# EasyEDA Pro project ProProject_基于CW32单片机的旋转变压器软件解码_2024-01-23.epro

# Schematic 基于CW32单片机的旋转变压器软件解码
Create Date: 2024-01-16; Page Name: 基于CW32单片机的墙体探测仪; Project Name: 基于CW32单片机的旋转变压器软件解码; Schematic Name: 基于CW32单片机的旋转变压器软件解码; Update Date: 2024-01-21; Company: 嘉立创EDA; Page Size: A2; Version: V1.0
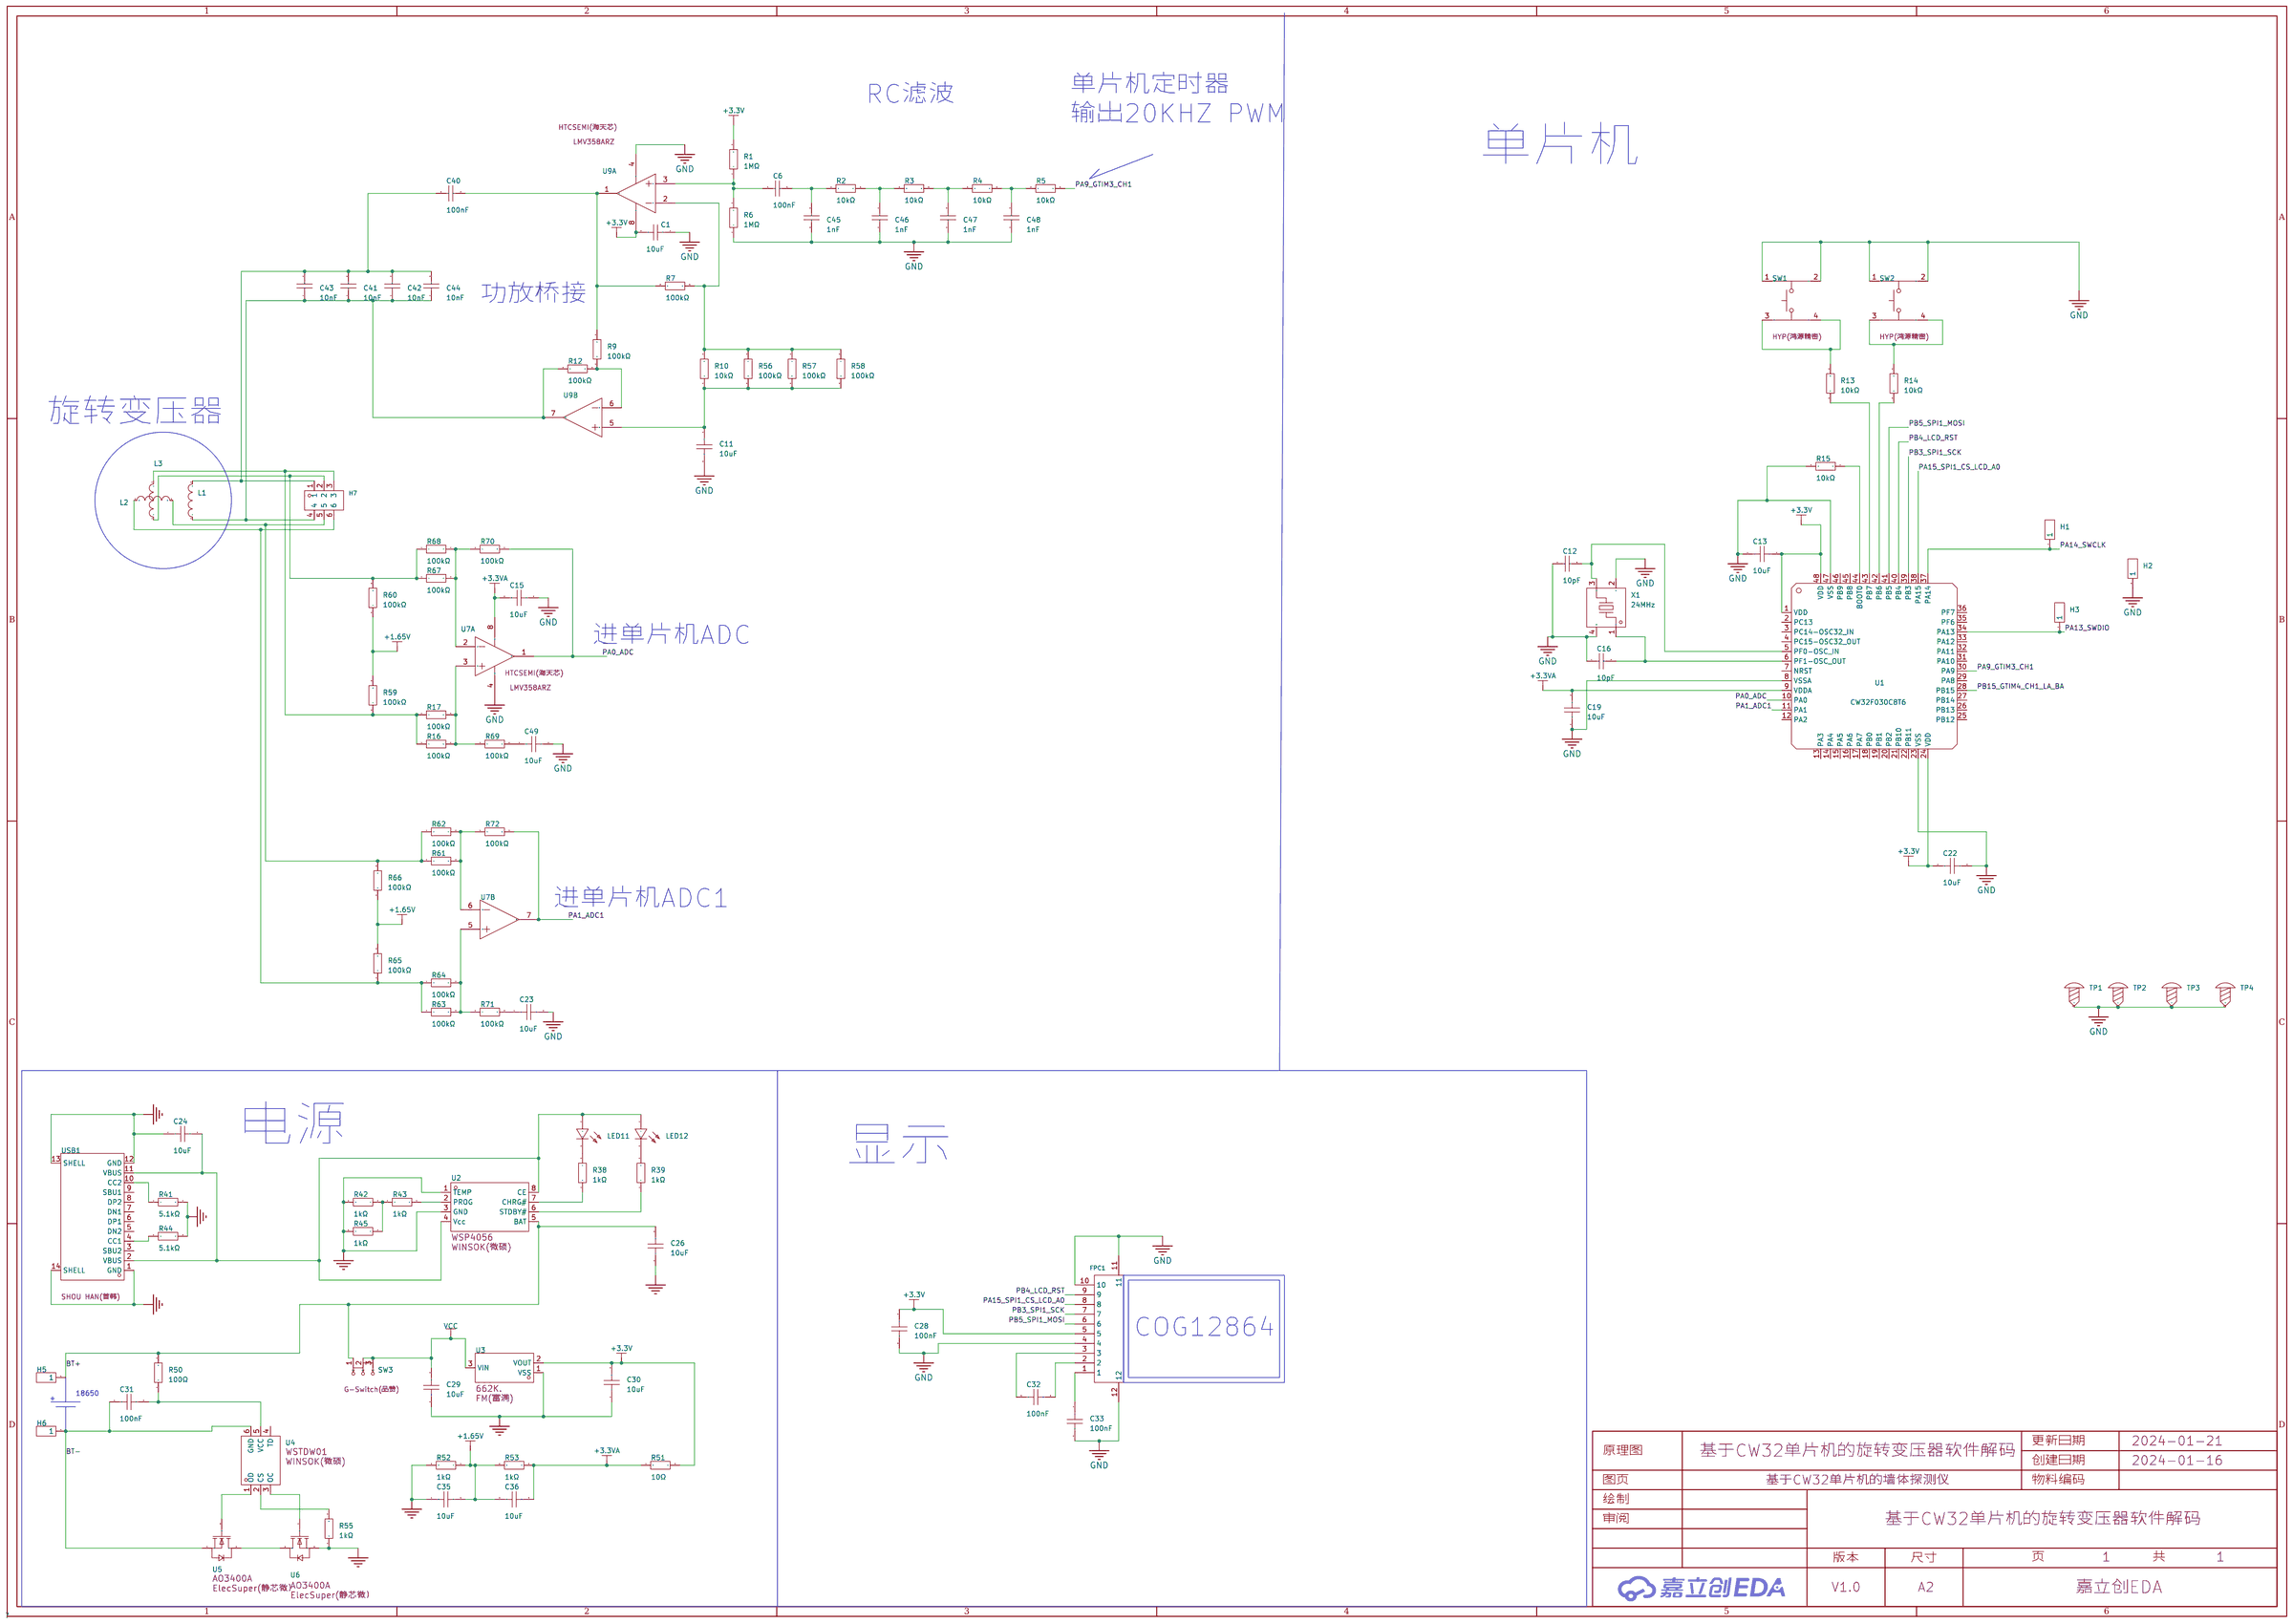
[diagram p0: schematic sheet]

## Parts
C1  10uF  [C0603]
C6  100nF  [C0603]
C11  10uF  [C0603]
C12  10pF  [C0603]
C13  10uF  [C0603]
C15  10uF  [C0603]
C16  10pF  [C0603]
C19  10uF  [C0603]
C22  10uF  [C0603]
C23  10uF  [C0603]
C24  10uF  [C0603]
C26  10uF  [C0603]
C28  100nF  [C0603]
C29  10uF  [C0603]
C30  10uF  [C0603]
C31  100nF  [C0603]
C32  100nF  [C0603]
C33  100nF  [C0603]
C35  10uF  [C0603]
C36  10uF  [C0603]
C40  100nF  [C0603]
C41  10nF  [C0603]
C42  10nF  [C0603]
C43  10nF  [C0603]
C44  10nF  [C0603]
C45  1nF  [C0603]
C46  1nF  [C0603]
C47  1nF  [C0603]
C48  1nF  [C0603]
C49  10uF  [C0603]
FPC1  -  [FPC-SMD_10P-P1.0_FGS-XJ-H2.0]
H1  -  [HDR-TH_1P-V-M_XKB_X4611WV-01I-C28D40]
H2  -  [HDR-TH_1P-V-M_XKB_X4611WV-01I-C28D40]
H3  -  [HDR-TH_1P-V-M_XKB_X4611WV-01I-C28D40]
H5  -  [HDR-TH_1P-V-M_XKB_X4611WV-01I-C28D40]
H6  -  [HDR-TH_1P-V-M_XKB_X4611WV-01I-C28D40]
H7  PZ254-2-03-Z-8.5  [HDR-TH_6P-P2.54-V-M-R2-C3-S2.54]
L1  6.3uH  [L1206]
L2  10uH  [L1206]
L3  10uH  [L1206]
LED11  204-10SURD/S530-A3-L  [LED-TH_BD3.0-P2.54-FD]
LED12  204-10SURD/S530-A3-L  [LED-TH_BD3.0-P2.54-FD]
R1  1MΩ  [R0603]
R2  10kΩ  [R0603]
R3  10kΩ  [R0603]
R4  10kΩ  [R0603]
R5  10kΩ  [R0603]
R6  1MΩ  [R0603]
R7  100kΩ  [R0603]
R9  100kΩ  [R0603]
R10  10kΩ  [R0603]
R12  100kΩ  [R0603]
R13  10kΩ  [R0603]
R14  10kΩ  [R0603]
R15  10kΩ  [R0603]
R16  100kΩ  [R0603]
R17  100kΩ  [R0603]
R38  1kΩ  [R0603]
R39  1kΩ  [R0603]
R41  5.1kΩ  [R0603]
R42  1kΩ  [R0603]
R43  1kΩ  [R0603]
R44  5.1kΩ  [R0603]
R45  1kΩ  [R0603]
R50  100Ω  [R0603]
R51  10Ω  [R0603]
R52  1kΩ  [R0603]
R53  1kΩ  [R0603]
R55  1kΩ  [R0603]
R56  100kΩ  [R0603]
R57  100kΩ  [R0603]
R58  100kΩ  [R0603]
R59  100kΩ  [R0603]
R60  100kΩ  [R0603]
R61  100kΩ  [R0603]
R62  100kΩ  [R0603]
R63  100kΩ  [R0603]
R64  100kΩ  [R0603]
R65  100kΩ  [R0603]
R66  100kΩ  [R0603]
R67  100kΩ  [R0603]
R68  100kΩ  [R0603]
R69  100kΩ  [R0603]
R70  100kΩ  [R0603]
R71  100kΩ  [R0603]
R72  100kΩ  [R0603]
SW1  -  [SW-TH_4P-L6.0-W6.0-P3.90-LS6.5]
SW2  -  [SW-TH_4P-L6.0-W6.0-P3.90-LS6.5]
SW3  SS-12F20-G070  [SW-TH_G-SWITCH_SS-12F20-G070]
TP1  -  [M3螺丝]
TP2  -  [M3螺丝]
TP3  -  [M3螺丝]
TP4  -  [M3螺丝]
U1  CW32F030C8T6  [LQFP-48_L7.0-W7.0-P0.50-LS9.0-TL]
U2  WSP4056  [SOP-8_L5.1-W3.9-P1.27-LS6.0-BL]
U3  662K.  [SOT-23-3_L2.9-W1.3-P1.90-LS2.4-BR]
U4  WSTDW01  [SOT-23-6_L2.9-W1.6-P0.95-LS2.8-BR]
U5  AO3400A  [SOT-23-3_L3.0-W1.6-P1.90-LS2.8-BR]
U6  AO3400A  [SOT-23-3_L3.0-W1.6-P1.90-LS2.8-BR]
U7  -  [SOP-8_L4.9-W3.9-P1.27-LS6.0-BL]  (sections 1,2)
U9  -  [SOP-8_L4.9-W3.9-P1.27-LS6.0-BL]  (sections 1,2)
USB1  TYPE-C16PIN2MD(073)  [USB-C-SMD_TYPE-C-6PIN-2MD-073]
X1  24MHz  [CRYSTAL-SMD_4P-L3.2-W2.5-BL]

## Library data of the parts
C1 C11 C13 C15 C19 C22-C24 C26 C29 C30 C35 C36 C49 = CL10A106KP8NNNC: 容值:10uF;精度:±10%;额定电压:10V;材质(温度系数):X5R;; LCSC Part Name: 10uF±10%10V; Supplier Part: C19702; Manufacturer: SAMSUNG(三星); Supplier Footprint: 0603; JLCPCB Part Class: BasicPart; Datasheet: https://atta.szlcsc.com/upload/public/pdf/source/20160103/1457707703378.pdf; Supplier: LCSC; Tolerance: ±10%; Voltage Rated: 10V; Temperature Coefficient: X5R
C6 C40 = 0603B104K500NT: 容值:100nF;精度:±10%;额定电压:50V;材质(温度系数):X7R;; LCSC Part Name: 100nF ±10% 50V; Supplier Part: C30926; Manufacturer: FH(风华); Supplier Footprint: 0603; JLCPCB Part Class: Extended Part; Datasheet: https://atta.szlcsc.com/upload/public/pdf/source/20200305/C486355_26A10D38EF8C2A5C37091D0039909270.pdf; Supplier: LCSC; Tolerance: ±10%; Voltage Rated: 50V; Temperature Coefficient: X7R
C12 C16 = CC0603JRNPO9BN100: 容值:10pF;精度:±5%;额定电压:50V;材质(温度系数):NP0;; LCSC Part Name: 10pF±5%50V; Supplier Part: C106245; Manufacturer: YAGEO(国巨); Supplier Footprint: 0603; JLCPCB Part Class: ExtendedPart; Datasheet: https://atta.szlcsc.com/upload/public/pdf/source/20170505/1493957837406.pdf; Supplier: LCSC; Tolerance: ±5%; Voltage Rated: 50V; Temperature Coefficient: NP0
C28 C31-C33 = CC0603KRX7R9BB104: 容值:100nF;精度:±10%;额定电压:50V;材质(温度系数):X7R;; LCSC Part Name: 100nF±10%50V; Supplier Part: C14663; Manufacturer: YAGEO(国巨); Supplier Footprint: 0603; JLCPCB Part Class: BasicPart; Datasheet: https://atta.szlcsc.com/upload/public/pdf/source/20180910/C282072_33301C7F631E79921B82A8DAC6BCC5B3.pdf; Supplier: LCSC; Tolerance: ±10%; Voltage Rated: 50V; Temperature Coefficient: X7R
C41-C44 = CC0603KRX7R9BB103: 容值:10nF;精度:±10%;额定电压:50V;材质(温度系数):X7R;; LCSC Part Name: 10nF ±10% 50V; Supplier Part: C100042; Manufacturer: YAGEO(国巨); Supplier Footprint: 0603; JLCPCB Part Class: 扩展库; Datasheet: https://atta.szlcsc.com/upload/public/pdf/source/20181008/C309510_22F155564471FAF6A489F7D68F34234E.pdf; Supplier: LCSC; Tolerance: ±10%; Voltage Rated: 50V; Temperature Coefficient: X7R
C45-C48 = CC0603JRNPO9BN102: 容值:1nF;精度:±5%;额定电压:50V;材质(温度系数):NP0;; LCSC Part Name: 1nF±5%50V; Supplier Part: C106246; Manufacturer: YAGEO(国巨); Supplier Footprint: 0603; JLCPCB Part Class: ExtendedPart; Datasheet: https://atta.szlcsc.com/upload/public/pdf/source/20170505/1493957838062.pdf; Supplier: LCSC; Tolerance: ±5%; Voltage Rated: 50V; Temperature Coefficient: NP0
FPC1 = AFA01-S10FCA-00: 间距:1mm;触点数量:10;锁定特性:翻盖式;安装类型:卧贴;触点类型:下接;; LCSC Part Name: FPC1.0MM10P翻盖式H2.0mm下接; Supplier Part: C262756; Manufacturer: JS(钜硕电子); Supplier Footprint: P=1mm; JLCPCB Part Class: ExtendedPart; Supplier: LCSC; Pitch: 1mm; Number of Contacts: 10; Locking Feature: 翻盖式; Mounting Type: 卧贴; Contact Type: 下接; Height Above Board: 2mm; FFC, FCB Thickness: 0.3mm~0.3mm
H1-H3 H5 H6 = HDR-M_2.54_1x1P: Supplier Part: C81276; Supplier Footprint: 插件; JLCPCB Part Class: ExtendedPart
H7 = PZ254-2-03-Z-8.5_C2894964: 排数:双排;总PIN位数:6;间距:2.54mm;插针结构:2x3P;行距:2.54mm;安装类型:直插;圆针/方针:方针;额定电流:3A;额定电压:-;配合针长度:6mm;塑高:2.5mm;端接针长度:3mm;触头材质:-;工作温度范围:-40℃~+105℃;颜色:黑色;; Supplier: LCSC; Supplier Part: C2894964; Manufacturer: HCTL(华灿天禄); JLCPCB Part Class: 扩展库; LCSC Part Name: 2.54mm 2x3P 直插 方针; Supplier Footprint: 直插,P=2.54mm; Number of Rows: 双排; Number of Pins: 6; Pitch: 2.54mm; Pin Structure: 2x3P; Row Spacing: 2.54mm; Mounting Type: 直插; Circluar Pins/Square Pins: 方针; Current Rating (Max): 3A; Length of Mating Pin: 6mm; Insulation Height: 2.5mm; Length of End Connection Pin: 3mm; Operating Temperature Range: -40℃~+105℃; Color: 黑色
L1-L3 = L_1206
LED11 LED12 = 204-10SURD/S530-A3-L: 发光颜色:红灯;二极管配置:-;主波长:624nm;色温:-;功率:60mW;安装方式:-;; LCSC Part Name: 红灯; Supplier Part: C99771; Manufacturer: EVERLIGHT(亿光); Supplier Footprint: 插件,D=3mm; JLCPCB Part Class: ExtendedPart; Datasheet: https://atta.szlcsc.com/upload/public/pdf/source/20170504/1493866972127.pdf; Supplier: LCSC; Emitted Color: 红灯; Lens Color: 雾状红; Dominant Wavelength: 624nm; Peak Wavelength: 632nm; Forward Current: 20mA; Power Dissipation: 60mW; Viewing Angle: 40°; Operating Temperature: -40℃~+85℃; Lamp Holder Type: 3mm圆形灯头
R1 R6 = 0603WAF1004T5E: 电阻类型:厚膜电阻;阻值:1MΩ;精度:±1%;功率:100mW;; LCSC Part Name: 1MΩ±1%100mW; Supplier Part: C22935; Manufacturer: UNI-ROYAL(厚声); Supplier Footprint: 0603; JLCPCB Part Class: BasicPart; Datasheet: https://atta.szlcsc.com/upload/public/pdf/source/20200306/C422600_1E6D84923E4A46A82E41ADD87F860B5C.pdf; Supplier: LCSC; Type: 厚膜电阻; Tolerance: ±1%; Power(Watts): 100mW; Temperature Coefficient: ±100ppm/℃; Overload Voltage (Max): 75V; Operating Temperature Range: -55℃~+155℃
R2-R5 R10 R13-R15 R41 R44 = RC0603FR-0710KL: 电阻类型:厚膜电阻;阻值:10kΩ;精度:±1%;功率:100mW;; LCSC Part Name: 10kΩ±1%100mW; Supplier Part: C98220; Manufacturer: YAGEO(国巨); Supplier Footprint: 0603; JLCPCB Part Class: ExtendedPart; Datasheet: https://atta.szlcsc.com/upload/public/pdf/source/20170522/1495423494387.pdf; Supplier: LCSC; Type: 厚膜电阻; Tolerance: ±1%; Power(Watts): 100mW; Temperature Coefficient: ±100ppm/℃; Overload Voltage (Max): 75V; Operating Temperature Range: -55℃~+155℃
R7 R9 R12 R16 R17 R56-R72 = RC0603FR-07100KL: 电阻类型:厚膜电阻;阻值:100kΩ;精度:±1%;功率:100mW;; LCSC Part Name: 100kΩ±1%100mW; Supplier Part: C14675; Manufacturer: YAGEO(国巨); Supplier Footprint: 0603; JLCPCB Part Class: ExtendedPart; Datasheet: https://atta.szlcsc.com/upload/public/pdf/source/20140324/1457707028752.pdf; Supplier: LCSC; Type: 厚膜电阻; Tolerance: ±1%; Power(Watts): 100mW; Temperature Coefficient: ±100ppm/℃; Overload Voltage (Max): 75V; Operating Temperature Range: -55℃~+155℃
R38 R39 R42 R43 R45 R52 R53 R55 = RC0603FR-071KL: 电阻类型:厚膜电阻;阻值:1kΩ;精度:±1%;功率:100mW;; LCSC Part Name: 1kΩ±1%100mW; Supplier Part: C22548; Manufacturer: YAGEO(国巨); Supplier Footprint: 0603; JLCPCB Part Class: ExtendedPart; Datasheet: https://atta.szlcsc.com/upload/public/pdf/source/20180312/7BD3618A8B6324EA6280B0497A051AB7.pdf; Supplier: LCSC; Type: 厚膜电阻; Tolerance: ±1%; Power(Watts): 100mW; Temperature Coefficient: ±100ppm/℃; Overload Voltage (Max): 75V; Operating Temperature Range: -55℃~+155℃
R50 = RC0603FR-07100RL: 电阻类型:厚膜电阻;阻值:100Ω;精度:±1%;功率:100mW;; LCSC Part Name: 100Ω±1%100mW; Supplier Part: C105588; Manufacturer: YAGEO(国巨); Supplier Footprint: 0603; JLCPCB Part Class: ExtendedPart; Datasheet: https://atta.szlcsc.com/upload/public/pdf/source/20170428/1493376742308.pdf; Supplier: LCSC; Type: 厚膜电阻; Tolerance: ±1%; Power(Watts): 100mW; Temperature Coefficient: ±100ppm/℃; Overload Voltage (Max): 75V; Operating Temperature Range: -55℃~+155℃
R51 = 0603WAF100JT5E: 电阻类型:厚膜电阻;阻值:10Ω;精度:±1%;功率:100mW;; LCSC Part Name: 10Ω±1%100mW; Supplier Part: C22859; Manufacturer: UNI-ROYAL(厚声); Supplier Footprint: 0603; JLCPCB Part Class: BasicPart; Datasheet: https://atta.szlcsc.com/upload/public/pdf/source/20200306/C422600_1E6D84923E4A46A82E41ADD87F860B5C.pdf; Supplier: LCSC; Type: 厚膜电阻; Tolerance: ±1%; Power(Watts): 100mW; Temperature Coefficient: ±400ppm/℃; Overload Voltage (Max): 75V; Operating Temperature Range: -55℃~+155℃
SW1 SW2 = 1TS005A-2500-5001: 触点电流:50mA;额定电压(DC):12V;额定功率:0.6W;绝缘电阻:100MΩ;电路结构:单刀单掷;安装方式:直插;带灯:无;作用力:250gf@±50gf;机械寿命:7万次;带支架:否;; LCSC Part Name: 6*6*5mm直插轻触开关; Supplier Part: C255811; Manufacturer: HYP(鸿源精密); Supplier Footprint: 插件,6x6mm; JLCPCB Part Class: ExtendedPart; Datasheet: https://atta.szlcsc.com/upload/public/pdf/source/20180720/C255811_DA12C4E3C20854D48E888AEA64926F5F.pdf; Supplier: LCSC; Contact Current: 50mA; Voltage Rating (DC): 12V; Power Rating: 0.6W; Insulation Resistance: 100MΩ; Circuit: 单刀单掷; Mounting Style: 直插; Actuator Style: 圆形按钮; Actuator/Cap Color: 黑色; With Lamp: 无; Operating Force: 250gf@±50gf; Mechanical Life: 7万次; Operating Temperature: -40℃~+90℃; Pin Style: PC引脚; Switch Length: 6mm; Switch Width: 6mm; Switch Height: 5mm; Strike Gundam: 否
SW3 = SS-12F20-G070: 额定电流(DC):500mA;额定电压(DC):250V;电路结构:单刀双掷;安装方式:直插;机械寿命:-;开关颜色:黑色;; LCSC Part Name: 柄长7mm直插两档滑动开关; Supplier Part: C2848914; Manufacturer: G-Switch(品赞); Supplier Footprint: 插件; JLCPCB Part Class: ExtendedPart; Datasheet: https://atta.szlcsc.com/upload/public/pdf/source/20210825/E0137178672C137814869A76188F885C.pdf; Supplier: LCSC; Current Rating (DC): 500mA; Voltage Rating (DC): 250V; Circuit: 单刀双掷; Mounting Style: 直插; Actuator Color: 黑色; Actuator Style: 矩形柱状; Pin Style: PC引脚; Switch Length: 11.5mm; Switch Width: 5.8mm; Switch Height: 12mm
TP1-TP4 = M3螺丝: Supplier Footprint: 插件
U1 = CW32F030C8T6_C3019113: CPU内核:ARMCortex-M0+;CPU最大主频:64MHz;工作电压范围:1.65V~5.5V;内部振荡器:有;外部时钟频率范围:4MHz~32MHz;程序FLASH容量:-;RAM总容量:8KB;EEPROM/数据FLASH容量:-;GPIO端口数量:39;ADC(单元数/通道数/位数):1@x16ch/12bit;DAC(单元数/通道数/位数):-;(E)PWM(单元数/通道数/位数):-;8位Timer数量:-;16位Timer数量:8;32位Timer数量:-;内部比较器数量:2;U; LCSC Part Name: ARMCortex-M0+64MHzRAM：8KB; Supplier Part: C3019113; Manufacturer: CW(芯源); Supplier Footprint: LQFP-48; JLCPCB Part Class: ExtendedPart; Datasheet: https://atta.szlcsc.com/upload/public/pdf/source/20220516/D60F5E1023A73FFF550D4A77416DDFBC.pdf; Supplier: LCSC; CPU Core: ARMCortex-M0+; Maximum Frequency: 64MHz; Supply Voltage Range: 1.65V~5.5V; Internal Oscillator: 有; External Clock Frequency Rang: 4MHz~32MHz; RAM Size: 8KB; GPIO Ports Number: 39; ADC (Units/Channels/bits): 1@x16ch/12bit; 16Bit Timer Number: 8; CMP Number: 2; U(S)ART Number: 3; I2C Number: 2; (Q)SPI Number: 2; Peripherals / Functions / Protocol Stacks: 片载温度传感器；DMA；看门狗；低电压检测；CRC校验; Operating Temperature Range: -40℃~105℃
U2 = WSP4056: Supplier Part: C2985892; Manufacturer: WINSOK(微硕); Supplier Footprint: SOP-8; JLCPCB Part Class: ExtendedPart; Supplier: LCSC
U3 = 662K.: 输出类型:-;; LCSC Part Name: 662K; Supplier Part: C841298; Manufacturer: FM(富满); Supplier Footprint: SOT23-3; JLCPCB Part Class: ExtendedPart; Datasheet: https://atta.szlcsc.com/upload/public/pdf/watermark/20200922/C841298_3E220732626B158CD6AC195AF78C7FB8.pdf; Supplier: LCSC
U4 = WSTDW01: 充电电池的类型:-;电池单元组数:-;最大充电电流:-;充满的电池组电压:-;最大供应电压:-;; Supplier Part: C86873; Manufacturer: WINSOK(微硕); Supplier Footprint: SOT-23-6; JLCPCB Part Class: ExtendedPart; Datasheet: https://atta.szlcsc.com/upload/public/pdf/source/20161110/1478743415995.pdf; Supplier: LCSC
U5 U6 = AO3400A_C5224194: 类型:N沟道;漏源电压(Vdss):30V;连续漏极电流(Id):6A;功率(Pd):1.4W;导通电阻(RDS(on)@Vgs,Id):19mΩ@10V,6.0A;; LCSC Part Name: N沟道30V6A; Supplier Part: C5224194; Manufacturer: ElecSuper(静芯微）; Supplier Footprint: SOT-23-3L; JLCPCB Part Class: ExtendedPart; Datasheet: https://atta.szlcsc.com/upload/public/pdf/source/20221027/D95D9171DDBB7BB324532F3AF1EADB7E.pdf; Supplier: LCSC; Type: N沟道; Drain Source Voltage (Vdss): 30V; Continuous Drain Current (Id): 6A; Power Dissipation (Pd): 1.4W; Drain Source On Resistance (RDS(on)@Vgs,Id): 19mΩ@10V,6.0A; Gate Threshold Voltage (Vgs(th)@Id): 1V@250uA
U7 U9 = LMV358ARZ: CMOS低功耗双路运算放大器; Supplier Part: C2928823; Manufacturer: HTCSEMI(海天芯); Supplier Footprint: SOP-8; JLCPCB Part Class: ExtendedPart; Datasheet: https://atta.szlcsc.com/upload/public/pdf/source/20220114/2D4B849A76DE33264688A93B3A90A0F8.pdf; Supplier: LCSC
USB1 = TYPE-C 16PIN 2MD(073): 连接器类型:Type-C;标准:-;公母:母座;触点数量:16;端口数量:1;安装方式:卧贴;额定电流-电源:5A;工作温度范围:-25℃~+85℃;; LCSC Part Name: TYPE-C母座16P4脚插件带定位柱不锈钢外壳2次模顶; Supplier Part: C2765186; Manufacturer: SHOU HAN(首韩); Supplier Footprint: SMD; JLCPCB Part Class: ExtendedPart; Datasheet: https://atta.szlcsc.com/upload/public/pdf/source/20211123/39B17C16241EAC15C5E277BDA434118E.pdf; Supplier: LCSC; Connector Type: Type-C; Gender: 母座; Number of Contacts: 16; Number of Ports: 1; Mounting Style: 卧贴; Current Rating - Power (Max): 5A; Operating Temperature Range: -25℃~+85℃
X1 = 3TJ424000HYFBC: 频率:24MHz;频率公差:±10ppm;负载电容:9pF;; LCSC Part Name: 24MHz ±10ppm 9pF; Supplier Part: C2149055; Manufacturer: JYJE(晶友嘉); Supplier Footprint: SMD3225-4P; JLCPCB Part Class: Extended Part; Datasheet: https://atta.szlcsc.com/upload/public/pdf/source/20210114/C2149013_C841380407E0329693B4ECED06382C6A.pdf; Supplier: LCSC; Crystal Type: 贴片无源晶振; Frequency Tolerance: ±10ppm; Frequency Stability: ±30ppm; Load Capacitance: 9pF; Equivalent Series Resistance (ESR): 60Ω; Operating Temperature: -40℃~+85℃

## Nets
+1.65V: C35.2 C36.1 R52.1 R53.2 R59.2 R60.1 R65.2 R66.1
+3.3V: C1.2 C13.2 C22.1 C28.1 C30.2 FPC1.5 R1.2 R51.2 U1.1(VDD) U1.24(VDD) U1.48(VDD) U3.2(VOUT) U9.8(VCC)
+3.3VA: C15.2 C19.2 C36.2 R51.1 R53.1 U1.9(VDDA) U7.8(VCC)
GND: C1.1 C11.2 C12.1 C13.1 C15.1 C16.1 C19.1 C22.2 C23.2 C24.1 C26.1 C28.2 C29.1 C30.1 C33.2 C35.1 C45.1 C46.1 C47.1 C48.1 C49.2 FPC1.4 FPC1.10 FPC1.11 FPC1.12 H2.1 R6.1 R15.2 R41.2 R42.2 R44.2 R45.2 R52.2 R55.1 SW1.1 SW1.2 SW2.1 SW2.2 TP1.1 TP2.1 TP3.1 TP4.1 U1.8(VSSA) U1.23(VSS) U1.47(VSS) U2.1(TEMP) U2.3(GND) U3.1(VSS) U6.2(S) U7.4(GND) U9.4(GND) USB1.1(GND) USB1.12(GND) USB1.13(SHELL) USB1.14(SHELL) X1.2(GND) X1.4(GND)
VCC: C29.2 SW3.2 SW3.3 U3.3(VIN)
BT+: C26.2 H5.1 R50.2 SW3.1 U2.5(BAT)
BT-: C31.1 H6.1 U4.6(GND) U5.2(S)
PA0_ADC: R70.2 U1.10(PA0) U7.1(OUT)
PA1_ADC1: R72.2 U1.11(PA1) U7.7(OUT2)
PA9_GTIM3_CH1: R5.2 U1.30(PA9)
PA13_SWDIO: H3.1 U1.34(PA13)
PA14_SWCLK: H1.1 U1.37(PA14)
PA15_SPI1_CS_LCD_A0: FPC1.8 U1.38(PA15)
PB3_SPI1_SCK: FPC1.7 U1.39(PB3)
PB4_LCD_RST: FPC1.9 U1.40(PB4)
PB5_SPI1_MOSI: FPC1.6 U1.41(PB5)
PB15_GTIM4_CH1_LA_BA: U1.28(PB15)
$1N13991: U5.3(D) U6.3(D)
$1N14154: U4.1(OD) U5.1(G)
$1N14198: U4.3(OC) U6.1(G)
$1N14351: R55.2 U4.2(CS)
$1N15015: R43.1 U2.2(PROG)
$1N15845: R38.1 U2.7(CHRG#)
$1N15894: R39.1 U2.6(STDBY#)
$1N16826: R44.1 USB1.4(CC1)
$1N16875: R41.1 USB1.10(CC2)
$1N19532: C31.2 R50.1 U4.5(VCC)
$1N165486: R42.1 R43.2 R45.1
$1N167672: C24.2 LED11.1(A) LED12.1(A) U2.4(Vcc) U2.8(CE) USB1.2(VBUS) USB1.11(VBUS)
$1N179497: LED11.2(K) R38.2
$1N179538: LED12.2(K) R39.2
$1N206778: R15.1 U1.44(BOOT0)
$1N234129: R13.1 SW1.3 SW1.4
$1N234138: R14.1 SW2.3 SW2.4
$1N234147: R13.2 U1.43(PB7)
$1N234151: R14.2 U1.42(PB6)
$1N252869: C33.1 FPC1.1
$1N252872: C32.2 FPC1.2
$1N252875: C32.1 FPC1.3
$1N256375: C46.2 R2.2 R3.1
$1N256389: C47.2 R3.2 R4.1
$1N256398: C48.2 R4.2 R5.1
$1N256743: C6.2 C45.2 R2.1
$1N263980: C6.1 R1.1 R6.2 U9.3(IN1+)
$1N274948: C16.2 U1.6(PF1-OSC_OUT) X1.1
$1N275074: C12.2 U1.5(PF0-OSC_IN) X1.3
$1N291348: R9.2 R12.1 U9.6(IN2-)
$1N303075: C40.2 R7.1 R9.1 U9.1(OUT)
$1N308887: R7.2 R10.2 R56.1 R57.1 R58.1 U9.2(IN1-)
$1N309457: C11.1 R10.1 R56.2 R57.2 R58.2 U9.5(IN2+)
Net-(C23-1): C23.1 R71.2
Net-(C40-1): C40.1 C41.2 C42.2 C43.2 C44.2 H7.1 L1.2
Net-(C41-1): C41.1 C42.1 C43.1 C44.1 H7.4 L1.1 R12.2 U9.7(OUT2)
Net-(C49-1): C49.1 R69.2
Net-(H7-2): H7.2 L3.1 R60.2 R67.1 R68.1
Net-(H7-3): H7.3 L3.2 R16.1 R17.1 R59.1
Net-(H7-5): H7.5 L2.2 R61.1 R62.1 R66.2
Net-(H7-6): H7.6 L2.1 R63.1 R64.1 R65.1
Net-(R16-2): R16.2 R17.2 R69.1 U7.3(IN1+)
Net-(R61-2): R61.2 R62.2 R72.1 U7.6(IN2-)
Net-(R63-2): R63.2 R64.2 R71.1 U7.5(IN2+)
Net-(R67-2): R67.2 R68.2 R70.1 U7.2(IN1-)

Not connected (* = marked no-connect by the designer): U1 2(PC13) 3(PC14-OSC32_IN) 4(PC15-OSC32_OUT) 7(NRST) 12(PA2) 13(PA3) 14(PA4) 15(PA5) 16(PA6) 17(PA7) 18(PB0) 19(PB1) 20(PB2) 21(PB10) 22(PB11) 25(PB12) 26(PB13) 27(PB14) 29(PA8) 31(PA10) 32(PA11) 33(PA12) 35(PF6) 36(PF7) 45(PB8) 46(PB9); U4 4(TD); USB1 3(SBU2) 5(DN2) 6(DP1) 7(DN1) 8(DP2) 9(SBU1)

## Notes on the sheet
- RC滤波
- 单片机定时器
  输出20KHZ PWM
- 单片机
- 功放桥接
- 旋转变压器
- 进单片机ADC
- 进单片机ADC1
- 电源
- 显示
- COG12864
- +
- 18650

# Board PCB3
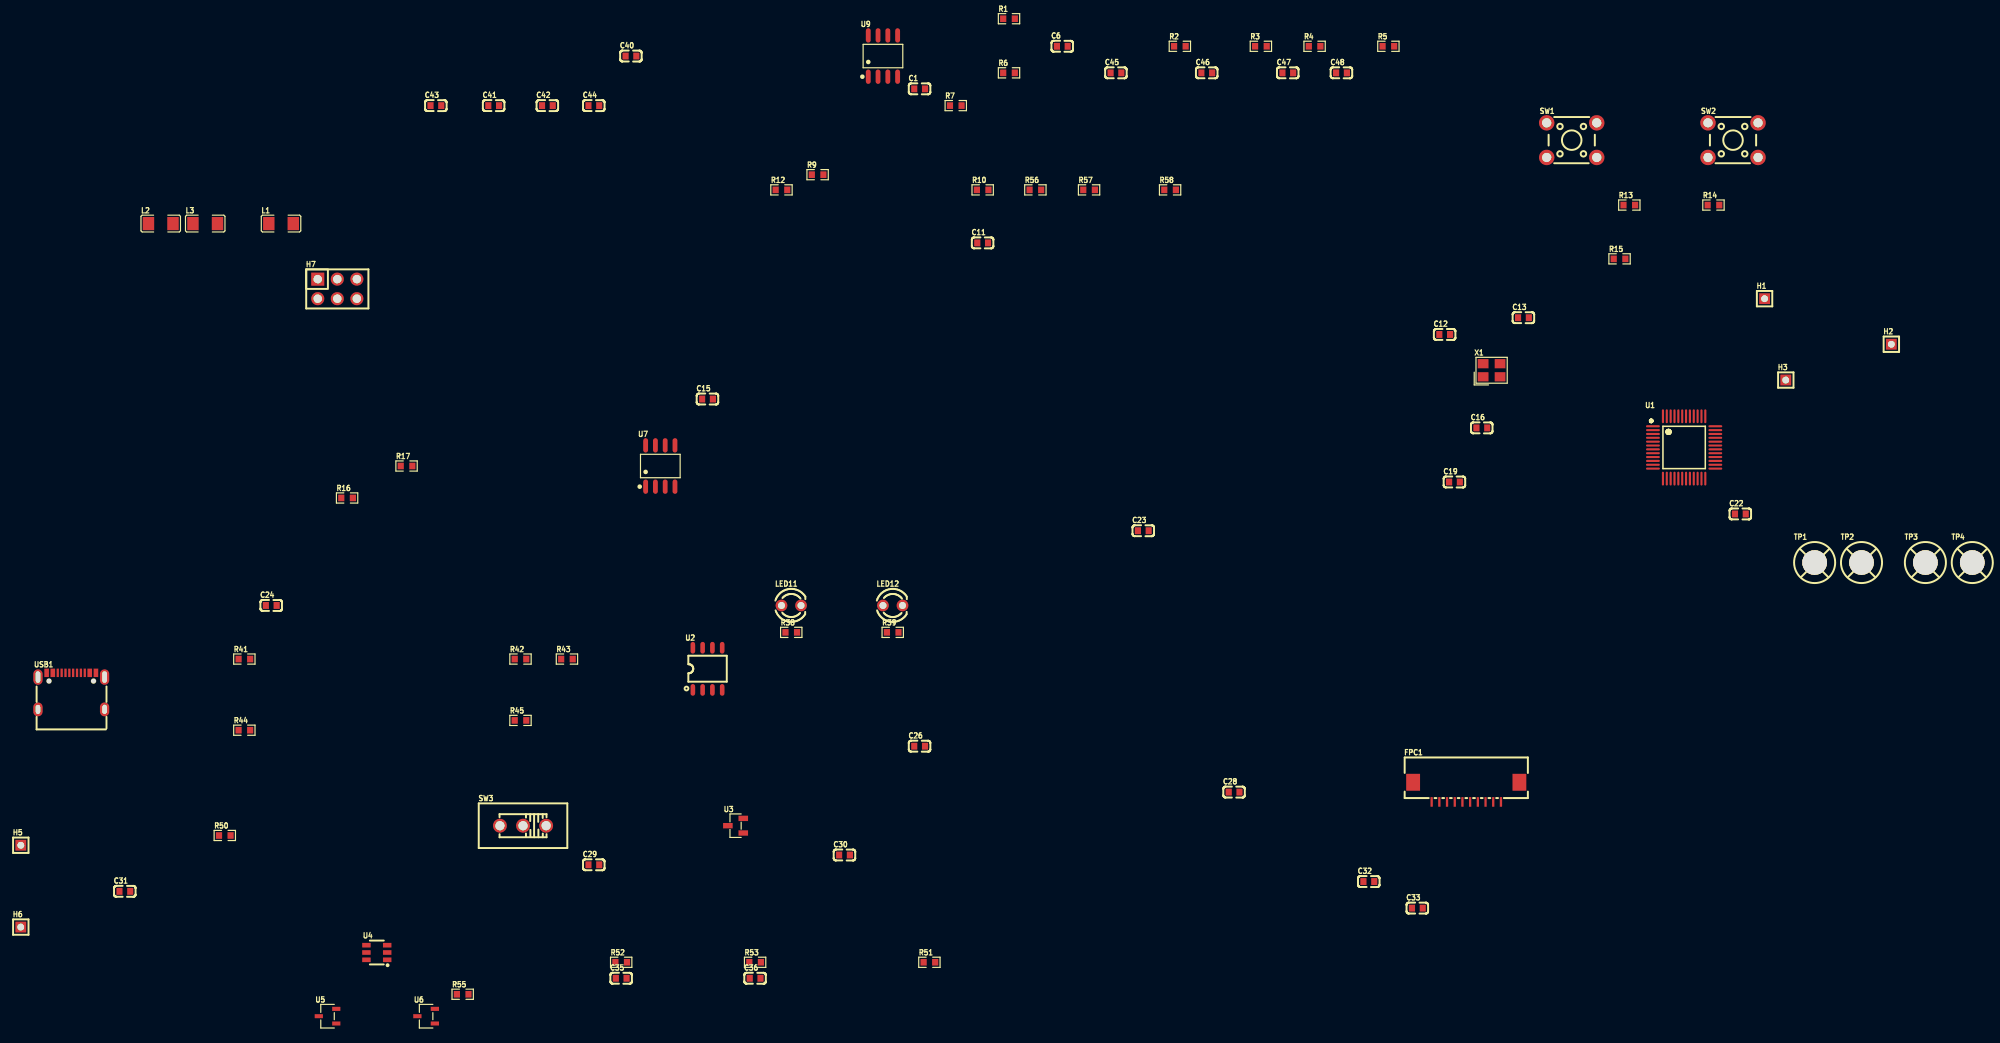
[diagram p1: board, top side]
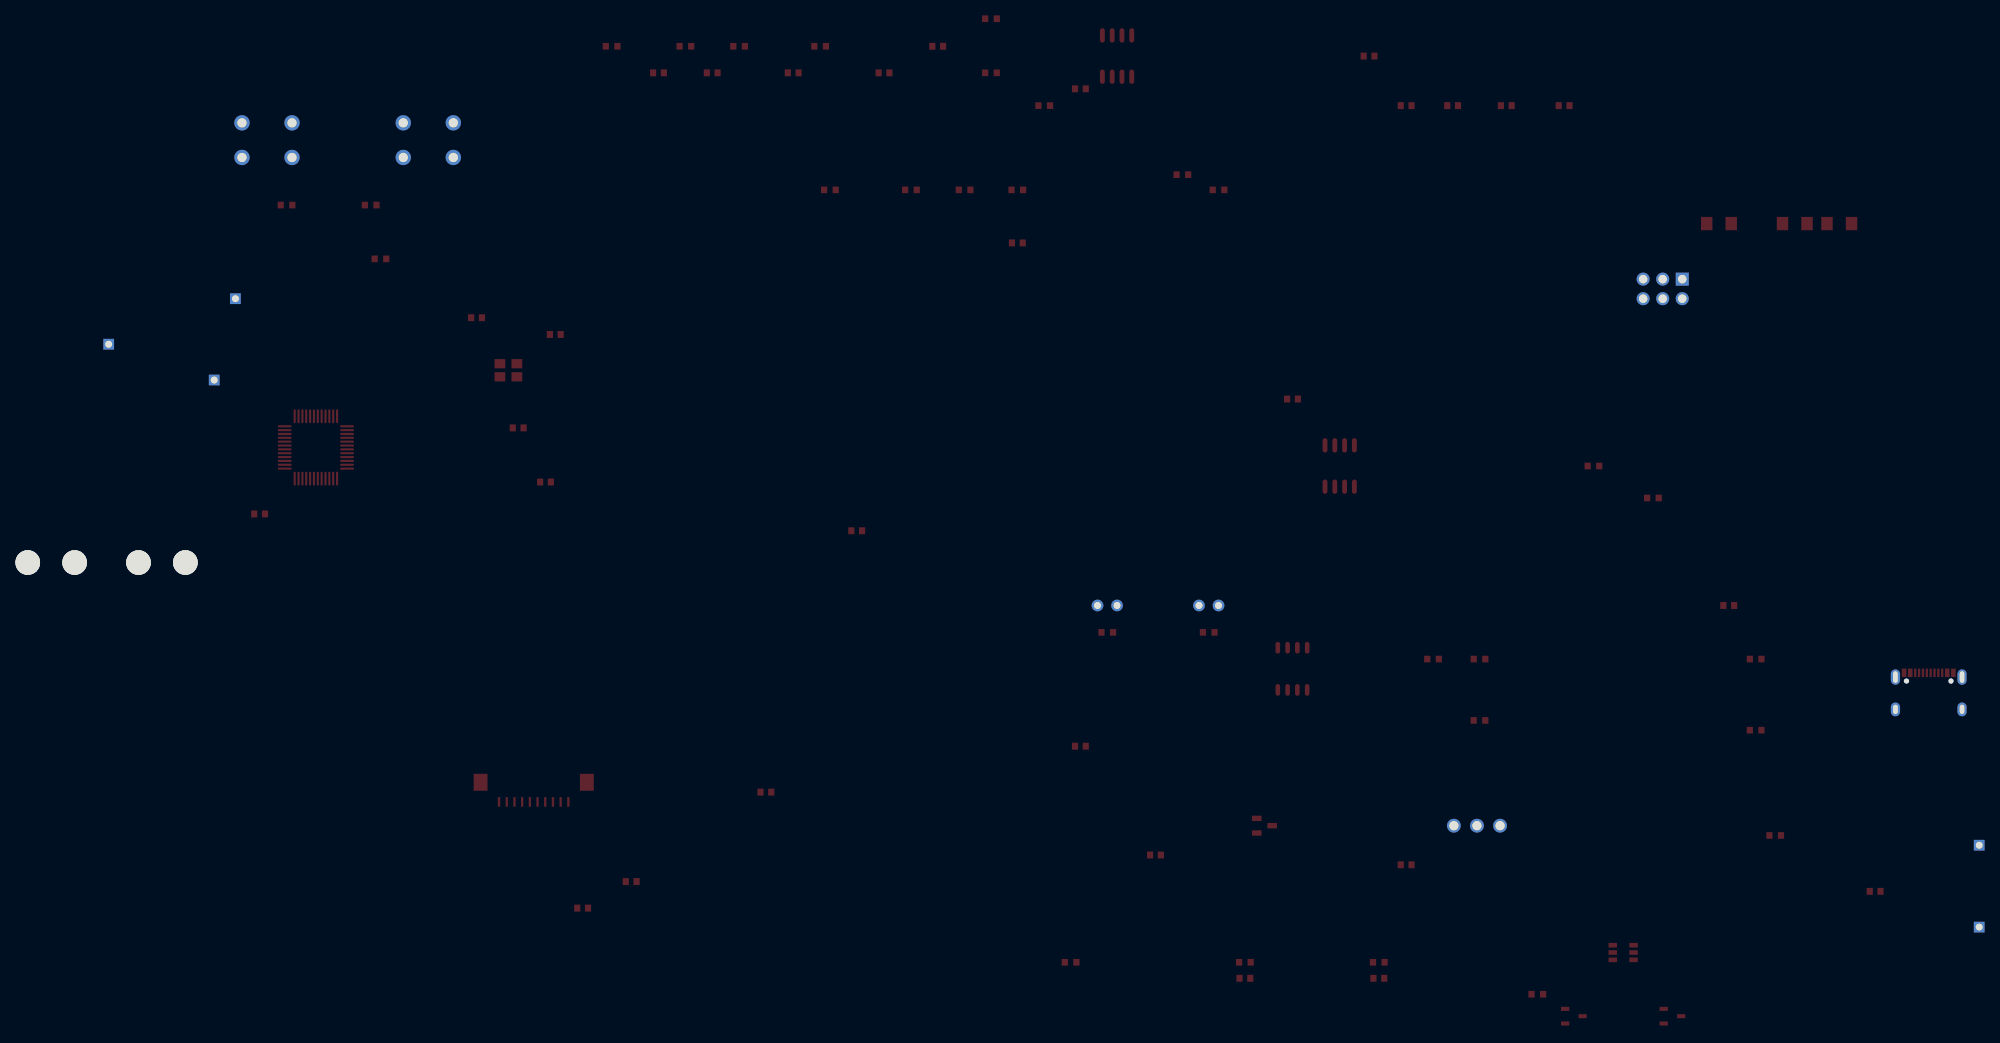
[diagram p2: board, bottom side, seen from below]

Outline 6.47 x 0.69 mm; copper layers: Top Layer, Bottom Layer. Coordinates in mm from the lower left corner of the outline.
Stack: Top Layer 0.035mm / Dielectric1 1.51mm FR4 er 4.5 / Bottom Layer 0.035mm

## Design rules (mm)
template: JLCPCB Capability(Two Layers Board)
spacing copperThickness1oz (default): track to track 0.102, other pairs 0.152 to 0.3
spacing copperThickness2oz: track to track 0.203, other pairs 0.152 to 0.3
track width copperThickness1oz (default): min 0.127, default 0.254, max 2.54
track width copperThickness2oz: min 0.203, default 0.254, max 2.54
differential pair differentialPair (default): width min 0.127, default 0.254, max 2.54; gap min 0.152, default 0.152
via viaSize (default): diameter min 0.5, default 0.61, max 10; hole min 0.3, default 0.305, max 6.3

## Placement (name value [footprint] x y rotation side)
C1  10uF  [C0603]  113.4 77.29 0 top
C6  100nF  [C0603]  131.93 82.82 0 top
C11  10uF  [C0603]  121.59 57.28 0 top
C12  10pF  [C0603]  181.59 45.38 0 top
C13  10uF  [C0603]  191.82 47.56 0 top
C15  10uF  [C0603]  85.86 36.99 0 top
C16  10pF  [C0603]  186.41 33.24 0 top
C19  10uF  [C0603]  182.86 26.21 0 top
C22  10uF  [C0603]  219.98 22.06 0 top
C23  10uF  [C0603]  142.45 19.88 0 top
C24  10uF  [C0603]  29.21 10.17 0 top
C26  10uF  [C0603]  113.4 -8.12 0 top
C28  100nF  [C0603]  154.24 -14.08 0 top
C29  10uF  [C0603]  71.1 -23.52 0 top
C30  10uF  [C0603]  103.65 -22.25 0 top
C31  100nF  [C0603]  10.2 -26.97 0 top
C32  100nF  [C0603]  171.74 -25.7 0 top
C33  100nF  [C0603]  178.04 -29.15 0 top
C35  10uF  [C0603]  74.65 -38.27 0 top
C36  10uF  [C0603]  92.04 -38.27 0 top
C40  100nF  [C0603]  75.92 81.55 0 top
C41  10nF  [C0603]  58.09 75.11 0 top
C42  10nF  [C0603]  65.07 75.11 0 top
C43  10nF  [C0603]  50.59 75.11 0 top
C44  10nF  [C0603]  71.1 75.11 0 top
C45  1nF  [C0603]  138.9 79.37 0 top
C46  1nF  [C0603]  150.69 79.37 0 top
C47  1nF  [C0603]  161.21 79.37 0 top
C48  1nF  [C0603]  168.19 79.37 0 top
FPC1  -  [FPC-SMD_10P-P1.0_FGS-XJ-H2.0]  184.39 -14.08 0 top
H1  -  [HDR-TH_1P-V-M_XKB_X4611WV-01I-C28D40]  223.13 50.03 0 top
H2  -  [HDR-TH_1P-V-M_XKB_X4611WV-01I-C28D40]  239.59 44.11 0 top
H3  -  [HDR-TH_1P-V-M_XKB_X4611WV-01I-C28D40]  225.88 39.46 0 top
H5  -  [HDR-TH_1P-V-M_XKB_X4611WV-01I-C28D40]  -3.32 -20.98 0 top
H6  -  [HDR-TH_1P-V-M_XKB_X4611WV-01I-C28D40]  -3.32 -31.62 0 top
H7  PZ254-2-03-Z-8.5  [HDR-TH_6P-P2.54-V-M-R2-C3-S2.54]  37.78 51.3 0 top
L1  6.3uH  [L1206]  30.48 59.79 0 top
L2  10uH  [L1206]  14.85 59.79 0 top
L3  10uH  [L1206]  20.63 59.79 0 top
LED11  204-10SURD/S530-A3-L  [LED-TH_BD3.0-P2.54-FD]  96.73 10.17 0 top
LED12  204-10SURD/S530-A3-L  [LED-TH_BD3.0-P2.54-FD]  109.91 10.17 0 top
R1  1MΩ  [R0603]  125.01 86.4 0 top
R2  10kΩ  [R0603]  147.2 82.82 0 top
R3  10kΩ  [R0603]  157.72 82.82 0 top
R4  10kΩ  [R0603]  164.69 82.82 0 top
R5  10kΩ  [R0603]  174.28 82.82 0 top
R6  1MΩ  [R0603]  125.01 79.37 0 top
R7  100kΩ  [R0603]  118.1 75.11 0 top
R9  100kΩ  [R0603]  100.16 66.14 0 top
R10  10kΩ  [R0603]  121.59 64.17 0 top
R12  100kΩ  [R0603]  95.46 64.17 0 top
R13  10kΩ  [R0603]  205.56 62.19 0 top
R14  10kΩ  [R0603]  216.49 62.19 0 top
R15  10kΩ  [R0603]  204.29 55.2 0 top
R16  100kΩ  [R0603]  39.05 24.14 0 top
R17  100kΩ  [R0603]  46.78 28.29 0 top
R38  1kΩ  [R0603]  96.73 6.67 0 top
R39  1kΩ  [R0603]  109.91 6.67 0 top
R41  5.1kΩ  [R0603]  25.71 3.21 0 top
R42  1kΩ  [R0603]  61.57 3.21 0 top
R43  1kΩ  [R0603]  67.61 3.21 0 top
R44  5.1kΩ  [R0603]  25.71 -6.04 0 top
R45  1kΩ  [R0603]  61.57 -4.77 0 top
R50  100Ω  [R0603]  23.17 -19.71 0 top
R51  10Ω  [R0603]  114.67 -36.19 0 top
R52  1kΩ  [R0603]  74.65 -36.19 0 top
R53  1kΩ  [R0603]  92.04 -36.19 0 top
R55  1kΩ  [R0603]  54.07 -40.34 0 top
R56  100kΩ  [R0603]  128.43 64.17 0 top
R57  100kΩ  [R0603]  135.41 64.17 0 top
R58  100kΩ  [R0603]  145.93 64.17 0 top
SW1  -  [SW-TH_4P-L6.0-W6.0-P3.90-LS6.5]  198.08 70.63 0 top
SW2  -  [SW-TH_4P-L6.0-W6.0-P3.90-LS6.5]  219.03 70.63 0 top
SW3  SS-12F20-G070  [SW-TH_G-SWITCH_SS-12F20-G070]  61.9 -18.44 0 top
TP1  -  [M3螺丝]  229.69 15.68 0 top
TP2  -  [M3螺丝]  235.78 15.68 0 top
TP3  -  [M3螺丝]  244.07 15.68 0 top
TP4  -  [M3螺丝]  250.16 15.68 0 top
U1  CW32F030C8T6  [LQFP-48_L7.0-W7.0-P0.50-LS9.0-TL]  212.68 30.7 0 top
U2  WSP4056  [SOP-8_L5.1-W3.9-P1.27-LS6.0-BL]  85.86 1.94 0 top
U3  662K.  [SOT-23-3_L2.9-W1.3-P1.90-LS2.4-BR]  89.5 -18.44 0 top
U4  WSTDW01  [SOT-23-6_L2.9-W1.6-P0.95-LS2.8-BR]  42.92 -34.92 0 top
U5  AO3400A  [SOT-23-3_L3.0-W1.6-P1.90-LS2.8-BR]  36.51 -43.19 0 top
U6  AO3400A  [SOT-23-3_L3.0-W1.6-P1.90-LS2.8-BR]  49.32 -43.19 0 top
U7  -  [SOP-8_L4.9-W3.9-P1.27-LS6.0-BL]  79.73 28.29 0 top
U9  -  [SOP-8_L4.9-W3.9-P1.27-LS6.0-BL]  108.64 81.55 0 top
USB1  TYPE-C16PIN2MD(073)  [USB-C-SMD_TYPE-C-6PIN-2MD-073]  3.24 -0.96 0 top
X1  24MHz  [CRYSTAL-SMD_4P-L3.2-W2.5-BL]  187.68 40.73 0 top

## Footprints (pads in the part's own frame, mm; a bottom-side part is the same pattern mirrored in y, then rotated)
C0603
  rect 0.8x0.9 smd: 1(-0.7,0) 2(0.7,0)
CRYSTAL-SMD_4P-L3.2-W2.5-BL
  rect 1.4x1.2 smd: 1(-1.1,-0.85) 2(1.1,-0.85) 3(1.1,0.85) 4(-1.1,0.85)
FPC-SMD_10P-P1.0_FGS-XJ-H2.0
  rect 0.3x1.25 smd: 1(-4.497,-1.276) 2(-3.498,-1.276) 3(-2.498,-1.276) 4(-1.497,-1.276) 5(-0.497,-1.276) 6(0.502,-1.276) 7(1.502,-1.276) 8(2.503,-1.276) 9(3.502,-1.274) 10(4.503,-1.274)
  rect 1.8x2.2 smd: 11(-6.9,1.276) 12(6.9,1.276)
HDR-TH_1P-V-M_XKB_X4611WV-01I-C28D40
  rect 1.4x1.4 hole 0.9: 1(0,0)
HDR-TH_6P-P2.54-V-M-R2-C3-S2.54
  rect 1.7x1.7 hole 1.1: 1(-2.54,1.27)
  round 1.7 hole 1.1: 2(0,1.27) 3(2.54,1.27) 4(-2.54,-1.27) 5(0,-1.27) 6(2.54,-1.27)
L1206
  rect 1.485x1.728 smd: 1(-1.593,0) 2(1.593,0)
LED-TH_BD3.0-P2.54-FD
  round 1.524 hole 0.914: 1(-1.27,0) 2(1.27,0)
LQFP-48_L7.0-W7.0-P0.50-LS9.0-TL
  oval 1.8x0.28 smd: 1(-4.05,2.75) 2(-4.05,2.25) 3(-4.05,1.75) 4(-4.05,1.25) 5(-4.05,0.75) 6(-4.05,0.25) 7(-4.05,-0.25) 8(-4.05,-0.75) 9(-4.05,-1.25) 10(-4.05,-1.75) 11(-4.05,-2.25) 12(-4.05,-2.75) 25(4.05,-2.75) 26(4.05,-2.25) 27(4.05,-1.75) 28(4.05,-1.25) 29(4.05,-0.75) 30(4.05,-0.25) 31(4.05,0.25) 32(4.05,0.75) 33(4.05,1.25) 34(4.05,1.75) 35(4.05,2.25) 36(4.05,2.75)
  oval 0.28x1.8 smd: 13(-2.75,-4.05) 14(-2.25,-4.05) 15(-1.75,-4.05) 16(-1.25,-4.05) 17(-0.75,-4.05) 18(-0.25,-4.05) 19(0.25,-4.05) 20(0.75,-4.05) 21(1.25,-4.05) 22(1.75,-4.05) 23(2.25,-4.05) 24(2.75,-4.05) 37(2.75,4.05) 38(2.25,4.05) 39(1.75,4.05) 40(1.25,4.05) 41(0.75,4.05) 42(0.25,4.05) 43(-0.25,4.05) 44(-0.75,4.05) 45(-1.25,4.05) 46(-1.75,4.05) 47(-2.25,4.05) 48(-2.75,4.05)
M3螺丝
  round 3.2 hole 3.2: 1(-0.064,0.064)
R0603
  rect 0.806x0.864 smd: 1(-0.753,0) 2(0.753,0)
SOP-8_L4.9-W3.9-P1.27-LS6.0-BL
  oval 0.63x1.865 smd: 1(-1.905,-2.683) 2(-0.635,-2.683) 3(0.635,-2.683) 4(1.905,-2.683) 5(1.905,2.683) 6(0.635,2.683) 7(-0.635,2.683) 8(-1.905,2.683)
SOP-8_L5.1-W3.9-P1.27-LS6.0-BL
  oval 0.6x1.52 smd: 1(-1.905,-2.74) 2(-0.635,-2.74) 3(0.635,-2.74) 4(1.905,-2.74) 5(1.905,2.74) 6(0.635,2.74) 7(-0.635,2.74) 8(-1.905,2.74)
SOT-23-3_L2.9-W1.3-P1.90-LS2.4-BR
  rect 1.25x0.7 smd: 1(1,-0.95) 2(1,0.95) 3(-1,0)
SOT-23-3_L3.0-W1.6-P1.90-LS2.8-BR
  rect 1.07x0.532 smd: 1(1.135,-0.95) 2(1.135,0.95) 3(-1.135,0)
SOT-23-6_L2.9-W1.6-P0.95-LS2.8-BR
  rect 1.1x0.6 smd: 1(1.35,-0.95) 2(1.35,0) 3(1.35,0.95) 4(-1.35,0.95) 5(-1.35,0) 6(-1.35,-0.95)
SW-TH_4P-L6.0-W6.0-P3.90-LS6.5
  round 2 hole 1.2: 1(-3.25,2.25) 2(3.25,2.25) 3(-3.25,-2.25) 4(3.25,-2.25)
SW-TH_G-SWITCH_SS-12F20-G070
  round 1.8 hole 1.2: 1(-3,0) 2(0,0) 3(3,0)
USB-C-SMD_TYPE-C-6PIN-2MD-073
  rect 0.6x1.1 smd: 1(-3.2,2.375) 2(-2.4,2.375) 11(2.4,2.375) 12(3.2,2.375)
  rect 0.3x1.1 smd: 3(-1.75,2.375) 4(-1.25,2.375) 5(-0.75,2.375) 6(-0.25,2.375) 7(0.25,2.375) 8(0.75,2.375) 9(1.25,2.375) 10(1.75,2.375)
  oval 1.2x2 hole 0.6x1.5: 13(-4.325,1.825) 14(4.325,1.825)
  oval 1.2x1.8 hole 0.6x1.2: 13(-4.325,-2.375) 14(4.325,-2.375)

## Nets
As in the schematic, except:
PA0_ADC: U1.10
$1N309178: C40.1 C41.2 C42.2 C43.2 C44.2
$1N309189: C41.1 C42.1 C43.1 C44.1 R12.2 U9.7

Pads without a net: C23 1; H7 1 2 3 4 5 6; L1 1 2; L2 1 2; L3 1 2; R16 1 2; R17 1 2; U1 2 3 4 7 11 12 13 14 15 16 17 18 19 20 21 22 25 26 27 29 31 32 33 35 36 45 46; U4 4; U7 1 2 3 5 6 7; USB1 3 5 6 7 8 9
